# EasyEDA Pro project 硬件部分大作业  大一  徐子涵 学号2025210236.epro, board PCB3
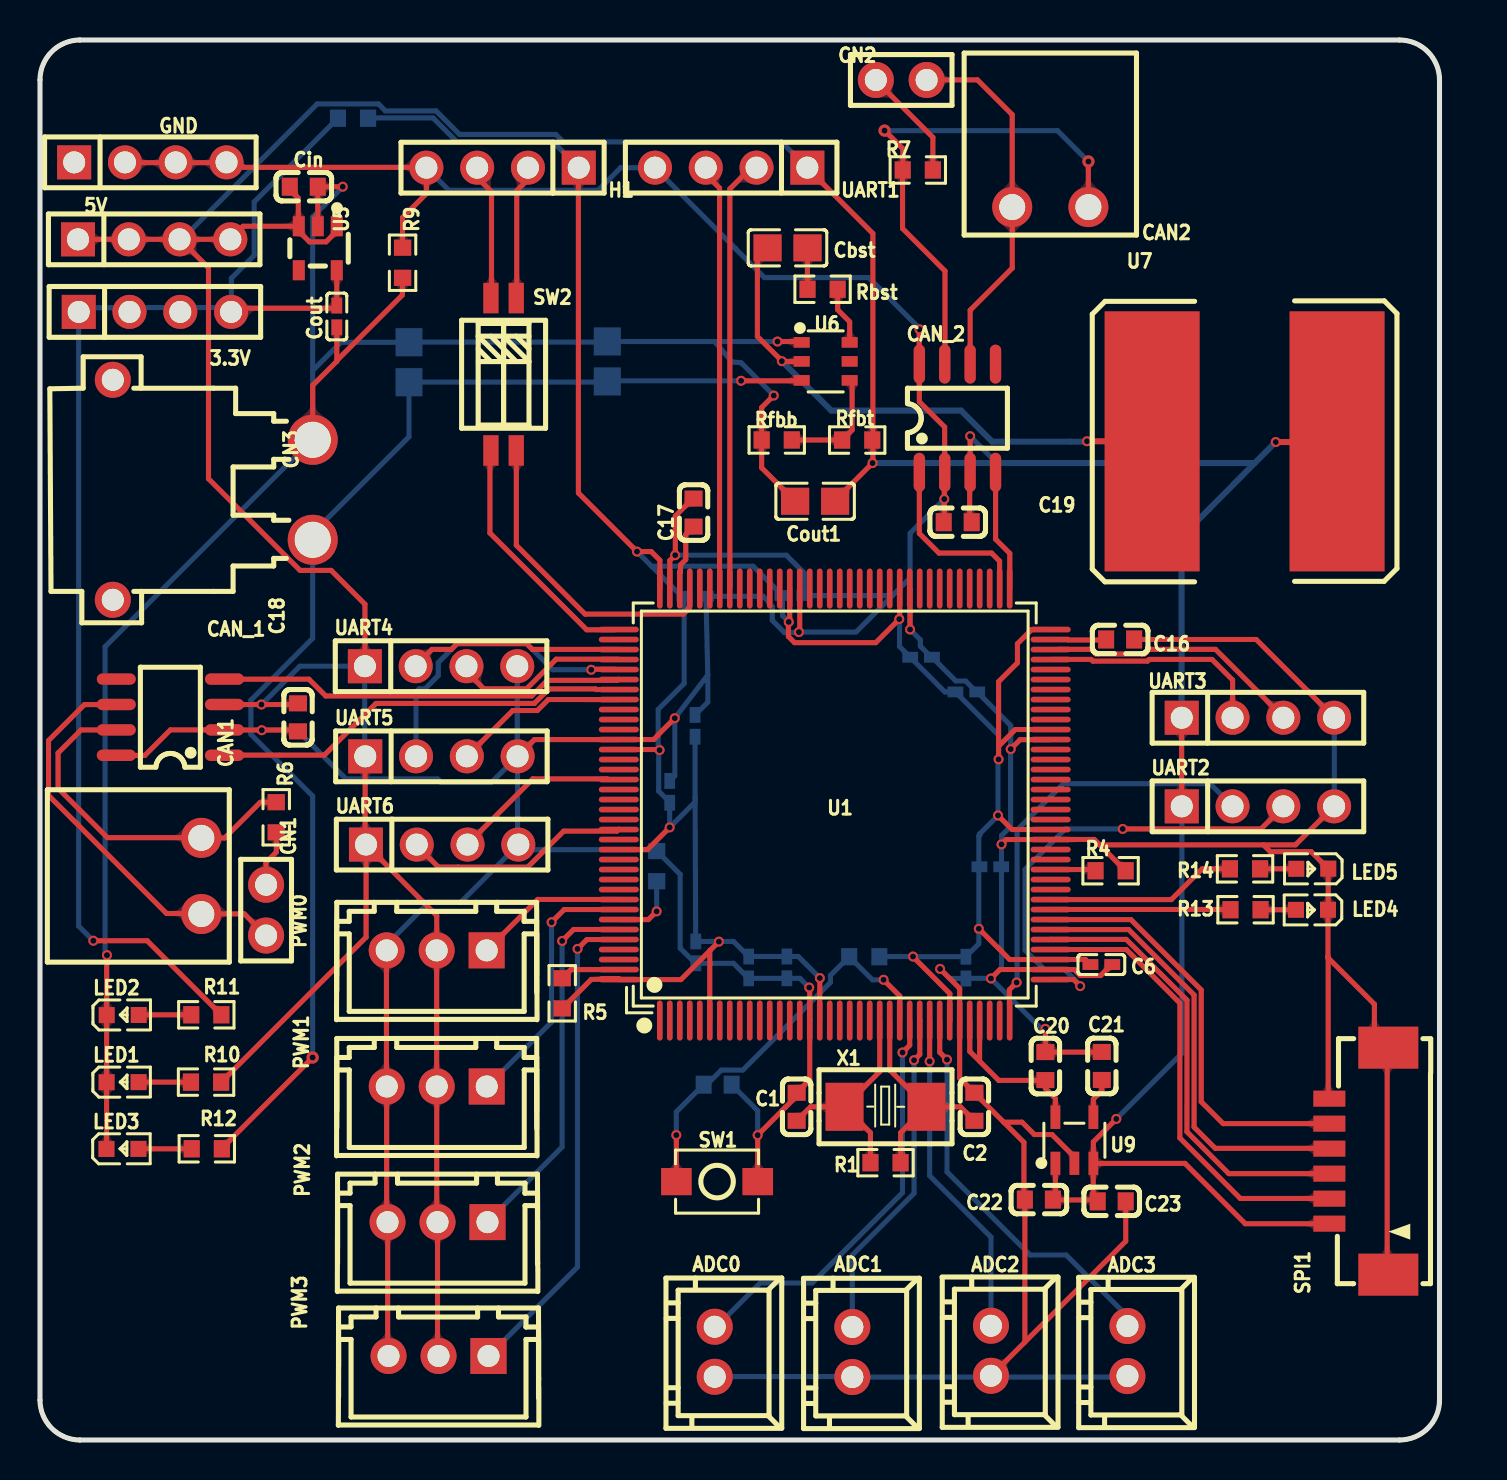
[diagram p1: board, top side]
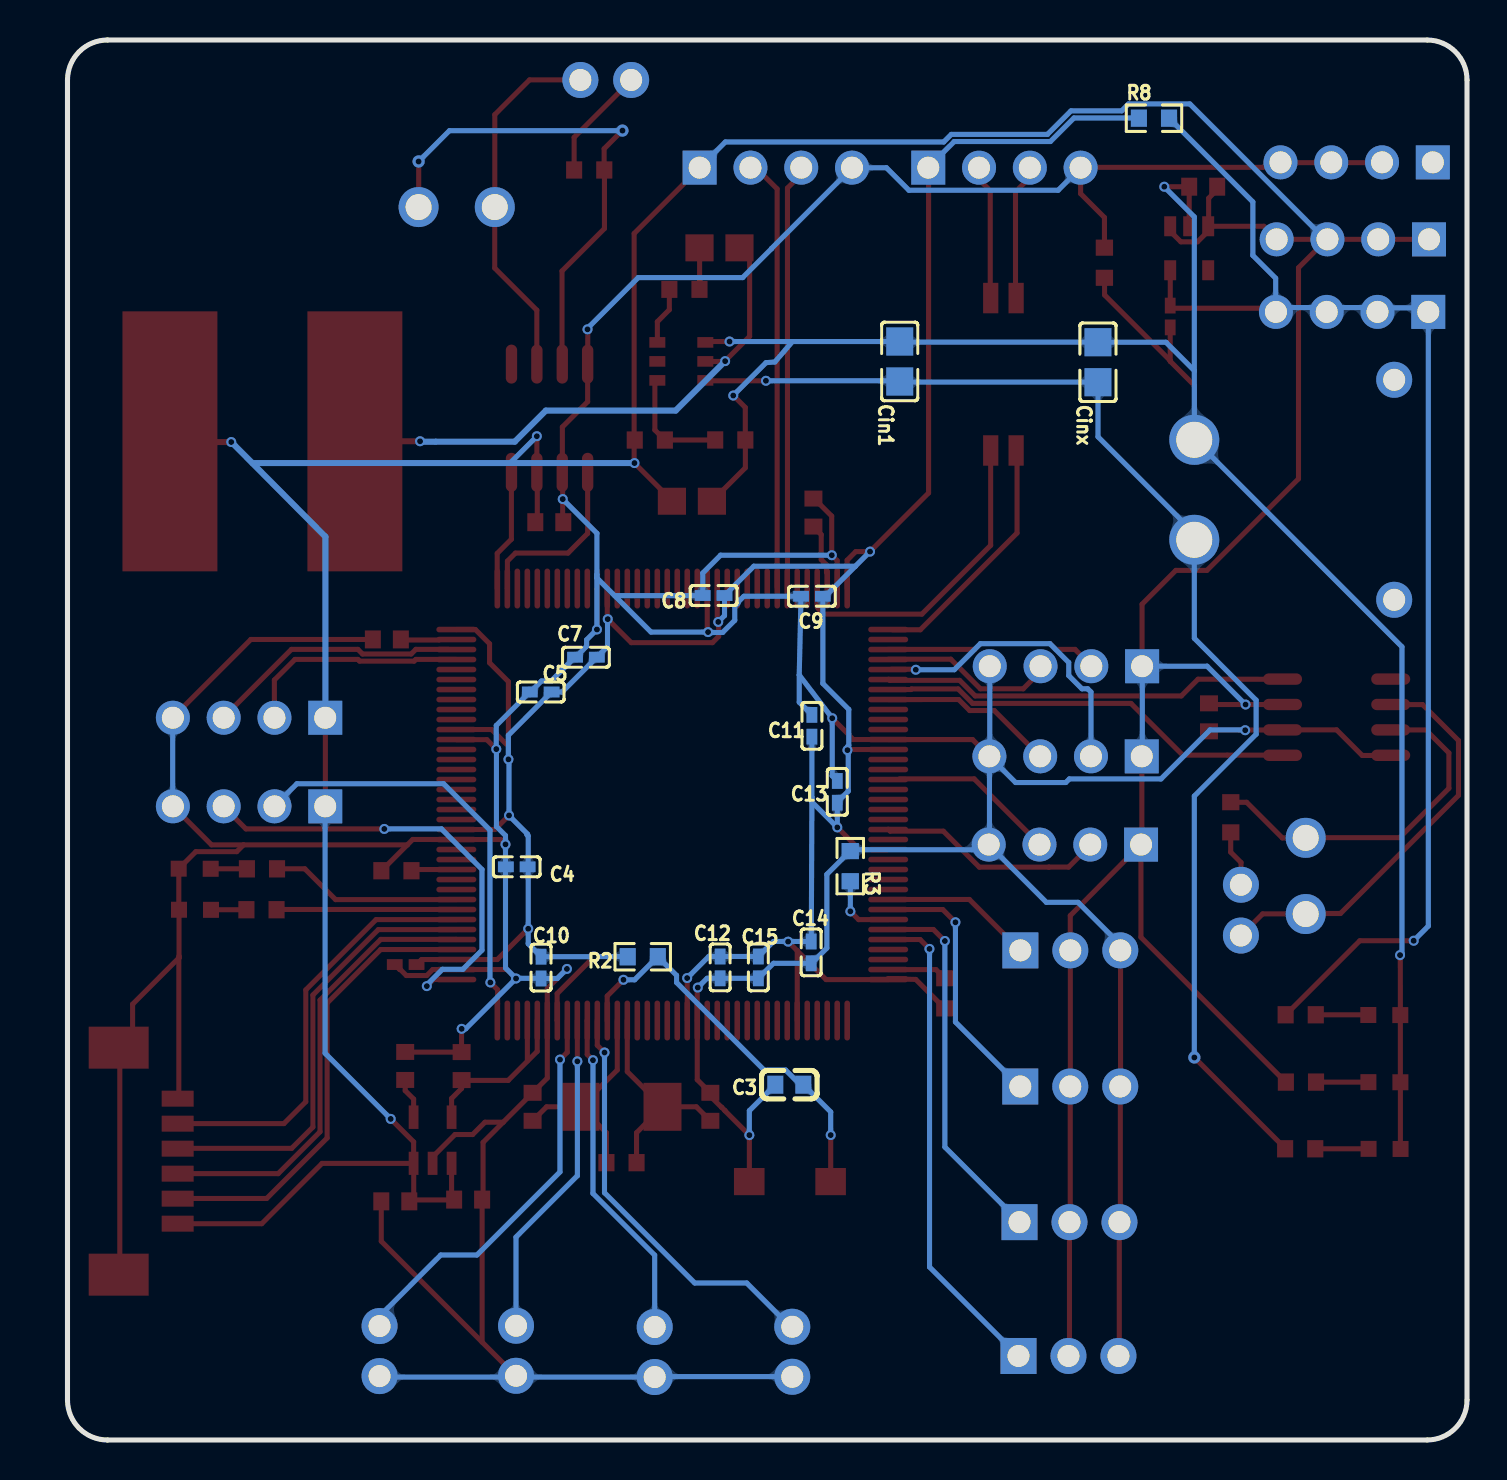
[diagram p2: board, bottom side, seen from below]

Outline 70 x 70 mm; copper layers: Top Layer, Bottom Layer. Coordinates in mm from the lower left corner of the outline.
Outline path: 0,68 0,2 arc(0.59,0.59) 2,0 68,0 arc(69.41,0.59) 70,2 70,68 arc(69.41,69.41) 68,70 2,70 arc(0.59,69.41) 0,68
Stack: Top Layer 0.035mm / Dielectric1 1.51mm FR4 er 4.5 / Bottom Layer 0.035mm

## Design rules (mm)
template: JLCPCB Capability(Two Layers Board)
spacing copperThickness1oz (default): track to track 0.102, other pairs 0.152 to 0.3
spacing copperThickness2oz: track to track 0.203, other pairs 0.152 to 0.3
track width copperThickness1oz (default): min 0.127, default 0.254, max 2.54
track width copperThickness2oz: min 0.203, default 0.254, max 2.54
differential pair differentialPair (default): width min 0.127, default 0.254, max 2.54; gap min 0.152, default 0.152
via viaSize (default): diameter min 0.5, default 0.61, max 10; hole min 0.3, default 0.305, max 6.3

## Placement (name value [footprint] x y rotation side)
3.3V  SIP4-CON4排针  [HDR-TH_4P-P2.54-V-M-3]  5.75 56.41 0 top
5V  SIP4-CON4排针  [HDR-TH_4P-P2.54-V-M-3]  5.71 60.03 0 top
ADC0  XH-D-2A  [CONN-TH_XH-2A]  33.75 4.41 270 top
ADC1  XH-D-2A  [CONN-TH_XH-2A]  40.63 4.4 270 top
ADC2  XH-D-2A  [CONN-TH_XH-2A]  47.57 4.46 270 top
ADC3  XH-D-2A  [CONN-TH_XH-2A]  54.39 4.45 270 top
C1  22pF  [C0603]  37.85 16.66 90 top
C2  22pF  [C0603]  46.74 16.66 90 top
C3  0.1uF  [C0603]  33.89 17.77 180 bottom
C4  0.1u  [C0402]  47.53 28.66 0 bottom
C5  0.1u  [C0402]  46.33 37.4 0 bottom
C6  0.1u  [C0402]  53.09 23.77 0 top
C7  0.1u  [C0402]  44.07 39.14 0 bottom
C8  0.1u  [C0402]  37.68 42.22 0 bottom
C9  0.1u  [C0402]  32.77 42.19 0 bottom
C10  0.1u  [C0402]  46.31 23.62 270 bottom
C11  0.1u  [C0402]  32.77 35.71 90 bottom
C12  0.1u  [C0402]  37.36 23.63 270 bottom
C13  0.1u  [C0402]  31.5 32.41 90 bottom
C14  0.1u  [C0402]  32.8 24.38 270 bottom
C15  0.1u  [C0402]  35.45 23.63 270 bottom
C16  2.2u  [C0603]  54.03 40.03 180 top
C17  2.2u  [C0603]  32.69 46.37 90 top
C18  0.1u  [C0603]  12.91 36.13 270 top
C19  0.1u  [C0603]  45.9 45.89 180 top
C20  10uF  [C0603]  50.29 18.7 270 top
C21  22nF  [C0603]  53.11 18.7 270 top
C22  10uF  [C0603]  49.96 12.02 0 top
C23  100nF  [C0603]  53.6 11.93 180 top
CAN1  XY2500R-F-3.81-2P  [CONN-TH_XY2500R-F-3.81-2P]  8.07 28.2 270 top
CAN2  XY2500R-F-3.81-2P  [CONN-TH_XY2500R-F-3.81-2P]  50.53 61.65 180 top
CAN_1  TJA1050T/CM,118  [SOIC-8_L5.0-W4.0-P1.27-LS6.0-BL]  6.52 36.14 90 top
CAN_2  TJA1050T/CM,118  [SOIC-8_L5.0-W4.0-P1.27-LS6.0-BL]  45.89 51.09 0 top
Cbst  100nF  [C0805]  37.39 59.61 180 top
Cin  1uF  [C0603]  13.2 62.66 180 top
Cin1  10uF  [C0805]  28.37 53.93 90 bottom
Cinx  100nF  [C0805]  18.46 53.89 90 bottom
CN1  JMP1  [HDR-TH_2P-P2.54_C9900022687]  11.31 26.49 270 top
CN2  JMP2  [HDR-TH_2P-P2.54_C9900022687]  43.08 68 0 top
CN3  XT30PW-M30.G.Y  [CONN-TH_XT30PW-M]  8.64 47.51 270 top
Cout  1uF  [C0402]  14.85 56.18 90 top
Cout1  22uF  [C0805]  38.77 46.94 0 top
GND  SIP4-CON4排针  [HDR-TH_4P-P2.54-V-M-3]  5.52 63.88 0 top
H1  2.5-4PIN  [HDR-TH_4P-P2.54-V-M]  23.14 63.62 180 top
LED1  -  [LED_0603]  4.18 17.9 0 top
LED2  -  [LED_0603]  4.19 21.26 0 top
LED3  -  [LED_0603]  4.18 14.56 0 top
LED4  -  [LED_0603]  63.57 26.5 180 top
LED5  -  [LED_0603]  63.59 28.56 180 top
PWM0  HX25003-3A  [CONN-TH_3P-P2.50_HX25003-3A]  19.84 24.48 0 top
PWM1  HX25003-3A  [CONN-TH_3P-P2.50_HX25003-3A]  19.84 17.68 0 top
PWM2  HX25003-3A  [CONN-TH_3P-P2.50_HX25003-3A]  19.88 10.89 0 top
PWM3  HX25003-3A  [CONN-TH_3P-P2.50_HX25003-3A]  19.93 4.2 0 top
R1  1M  [R0603]  42.29 13.87 180 top
R2  10k  [R0603]  41.23 24.16 0 bottom
R3  10K  [R0603]  30.85 28.69 90 bottom
R4  10K  [R0603]  53.55 28.46 0 top
R5  0R  [R0603]  26.12 22.33 270 top
R6  120  [R0603]  11.82 31.14 270 top
R7  120  [R0603]  43.91 63.5 0 top
R8  0  [R0603]  15.66 66.09 180 bottom
R9  0  [R0603]  18.14 58.86 270 top
R10  15K  [R0603]  8.31 17.9 180 top
R11  10K  [R0603]  8.32 21.26 180 top
R12  72K  [R0603]  8.34 14.56 180 top
R13  10K  [R0603]  60.3 26.51 0 top
R14  10K  [R0603]  60.27 28.56 0 top
Rbst  30Ω  [R0603]  39.14 57.54 180 top
Rfbb  10kΩ  [R0603]  36.85 50 0 top
Rfbt  52.3kΩ  [R0603]  40.87 50 0 top
SPI1  M1250RS-06P  [CONN-SMD_M1250RS-06P]  65.96 13.94 90 top
SW1  -  [Key_SMD_3x4x2]  33.87 12.92 0 top
SW2  DSHP02TSGET  [SW-SMD_4P_DSHP02TSGET]  23.19 53.29 180 top
U1  STM32F407ZGT6  [LQFP-144_L20.0-W20.0-P0.50-LS22.0-BL]  39.75 31.77 0 top
U5  LP5907MFX-3.0/NOPB(MS)  [SOT-23-5_L2.9-W1.6-P0.95-LS2.8-BR]  13.9 59.59 90 top
U6  TPS56339DDCR  [TSOT-23-6_L2.9-W1.6-P0.95-LS2.8-BR]  39.3 53.93 180 top
U7  5.6uH  [IND-SMD_L13.0-W13.0-SDR1307-XXXXX]  60.25 49.93 0 top
U9  RT9193-33GB  [SOT-23-5_L3.0-W1.7-P0.95-LS2.8-BL]  51.74 14.99 0 top
UART1  SIP4-CON4排针  [HDR-TH_4P-P2.54-V-M-3]  34.57 63.62 180 top
UART2  SIP4-CON4排针  [HDR-TH_4P-P2.54-V-M-3]  60.92 31.68 0 top
UART3  SIP4-CON4排针  [HDR-TH_4P-P2.54-V-M-3]  60.92 36.11 0 top
UART4  SIP4-CON4排针  [HDR-TH_4P-P2.54-V-M-3]  20.06 38.69 0 top
UART5  SIP4-CON4排针  [HDR-TH_4P-P2.54-V-M-3]  20.08 34.18 0 top
UART6  SIP4-CON4排针  [HDR-TH_4P-P2.54-V-M-3]  20.11 29.77 0 top
X1  8MHz  [CRYSTAL-SMD_L5.0-W3.2]  42.29 16.66 180 top

## Footprints (pads in the part's own frame, mm; a bottom-side part is the same pattern mirrored in y, then rotated)
C0402
  rect 0.79x0.54 smd: 1(-0.545,0) 2(0.545,0)
C0603
  rect 0.8x0.9 smd: 1(-0.7,0) 2(0.7,0)
C0805
  rect 1.41x1.35 smd: 1(-1,0) 2(1,0)
CONN-SMD_M1250RS-06P
  rect 0.8x1.6 smd: 1(-3.125,1.475) 2(-1.875,1.475) 3(-0.625,1.475) 4(0.625,1.475) 5(1.875,1.475) 6(3.125,1.475)
  rect 2.1x3 smd: 7(5.675,-1.475) 8(-5.675,-1.475)
CONN-TH_3P-P2.50_HX25003-3A
  rect 1.8x1.8 hole 1.1: 1(2.5,0)
  round 1.8 hole 1.1: 2(0,0) 3(-2.5,0)
CONN-TH_XH-2A
  round 1.8 hole 1.1: 1(-1.251,0) 2(1.251,0)
CONN-TH_XT30PW-M
  round 2.5 hole 1.8: 1(-2.5,5) 2(2.5,5)
  round 1.8 hole 1.1: 3(5.5,-5) 4(-5.5,-5)
CONN-TH_XY2500R-F-3.81-2P
  round 2 hole 1.3: 1(-1.905,0) 2(1.905,0)
CRYSTAL-SMD_L5.0-W3.2
  rect 1.9x2.4 smd: 1(-2.05,0) 2(2.05,0)
HDR-TH_2P-P2.54_C9900022687
  round 1.8 hole 1.1: 1(-1.27,0) 2(1.27,0)
HDR-TH_4P-P2.54-V-M
  rect 1.7x1.7 hole 1.1: 1(-3.81,0)
  round 1.7 hole 1.1: 2(-1.27,0) 3(1.27,0) 4(3.81,0)
HDR-TH_4P-P2.54-V-M-3
  rect 1.7x1.7 hole 1.1: 1(-3.81,0)
  round 1.7 hole 1.1: 2(-1.27,0) 3(1.27,0) 4(3.81,0)
IND-SMD_L13.0-W13.0-SDR1307-XXXXX
  rect 4.75x13 smd: 1(-4.625,0) 2(4.625,0)
Key_SMD_3x4x2
  rect 1.53x1.36 smd: 1(-2.035,0) 2(2.035,0)
LED_0603
  rect 0.8x0.8 smd: 1(-0.851,-0.01) 2(0.75,-0.005)
LQFP-144_L20.0-W20.0-P0.50-LS22.0-BL
  oval 0.28x2 smd: 1(-8.75,-10.8) 2(-8.25,-10.8) 3(-7.75,-10.8) 4(-7.25,-10.8) 5(-6.75,-10.8) 6(-6.25,-10.8) 7(-5.75,-10.8) 8(-5.25,-10.8) 9(-4.75,-10.8) 10(-4.25,-10.8) 11(-3.75,-10.8) 12(-3.25,-10.8) 13(-2.75,-10.8) 14(-2.25,-10.8) 15(-1.75,-10.8) 16(-1.25,-10.8) 17(-0.75,-10.8) 18(-0.25,-10.8) 19(0.25,-10.8) 20(0.75,-10.8) 21(1.25,-10.8) 22(1.75,-10.8) 23(2.25,-10.8) 24(2.75,-10.8) 25(3.25,-10.8) 26(3.75,-10.8) 27(4.25,-10.8) 28(4.75,-10.8) 29(5.25,-10.8) 30(5.75,-10.8) 31(6.25,-10.8) 32(6.75,-10.8) 33(7.25,-10.8) 34(7.75,-10.8) 35(8.25,-10.8) 36(8.75,-10.8) 73(8.75,10.8) 74(8.25,10.8) 75(7.75,10.8) 76(7.25,10.8) 77(6.75,10.8) 78(6.25,10.8) 79(5.75,10.8) 80(5.25,10.8) 81(4.75,10.8) 82(4.25,10.8) 83(3.75,10.8) 84(3.25,10.8) 85(2.75,10.8) 86(2.25,10.8) 87(1.75,10.8) 88(1.25,10.8) 89(0.75,10.8) 90(0.25,10.8) 91(-0.25,10.8) 92(-0.75,10.8) 93(-1.25,10.8) 94(-1.75,10.8) 95(-2.25,10.8) 96(-2.75,10.8) 97(-3.25,10.8) 98(-3.75,10.8) 99(-4.25,10.8) 100(-4.75,10.8) 101(-5.25,10.8) 102(-5.75,10.8) 103(-6.25,10.8) 104(-6.75,10.8) 105(-7.25,10.8) 106(-7.75,10.8) 107(-8.25,10.8) 108(-8.75,10.8)
  oval 2x0.28 smd: 37(10.8,-8.75) 38(10.8,-8.25) 39(10.8,-7.75) 40(10.8,-7.25) 41(10.8,-6.75) 42(10.8,-6.25) 43(10.8,-5.75) 44(10.8,-5.25) 45(10.8,-4.75) 46(10.8,-4.25) 47(10.8,-3.75) 48(10.8,-3.25) 49(10.8,-2.75) 50(10.8,-2.25) 51(10.8,-1.75) 52(10.8,-1.25) 53(10.8,-0.75) 54(10.8,-0.25) 55(10.8,0.25) 56(10.8,0.75) 57(10.8,1.25) 58(10.8,1.75) 59(10.8,2.25) 60(10.8,2.75) 61(10.8,3.25) 62(10.8,3.75) 63(10.8,4.25) 64(10.8,4.75) 65(10.8,5.25) 66(10.8,5.75) 67(10.8,6.25) 68(10.8,6.75) 69(10.8,7.25) 70(10.8,7.75) 71(10.8,8.25) 72(10.8,8.75) 109(-10.8,8.75) 110(-10.8,8.25) 111(-10.8,7.75) 112(-10.8,7.25) 113(-10.8,6.75) 114(-10.8,6.25) 115(-10.8,5.75) 116(-10.8,5.25) 117(-10.8,4.75) 118(-10.8,4.25) 119(-10.8,3.75) 120(-10.8,3.25) 121(-10.8,2.75) 122(-10.8,2.25) 123(-10.8,1.75) 124(-10.8,1.25) 125(-10.8,0.75) 126(-10.8,0.25) 127(-10.8,-0.25) 128(-10.8,-0.75) 129(-10.8,-1.25) 130(-10.8,-1.75) 131(-10.8,-2.25) 132(-10.8,-2.75) 133(-10.8,-3.25) 134(-10.8,-3.75) 135(-10.8,-4.25) 136(-10.8,-4.75) 137(-10.8,-5.25) 138(-10.8,-5.75) 139(-10.8,-6.25) 140(-10.8,-6.75) 141(-10.8,-7.25) 142(-10.8,-7.75) 143(-10.8,-8.25) 144(-10.8,-8.75)
R0603
  rect 0.806x0.864 smd: 1(-0.753,0) 2(0.753,0)
SOIC-8_L5.0-W4.0-P1.27-LS6.0-BL
  oval 0.569x1.95 smd: 1(-1.905,-2.705) 2(-0.635,-2.705) 3(0.635,-2.705) 4(1.905,-2.705) 5(1.905,2.705) 6(0.635,2.705) 7(-0.635,2.705) 8(-1.905,2.705)
SOT-23-5_L2.9-W1.6-P0.95-LS2.8-BR
  rect 1x0.6 smd: 1(1.1,-0.95) 2(1.1,0) 3(1.1,0.95) 4(-1.1,0.95) 5(-1.1,-0.95)
SOT-23-5_L3.0-W1.7-P0.95-LS2.8-BL
  rect 0.49x1.157 smd: 1(-0.95,-1.153) 2(0,-1.153) 3(0.95,-1.153)
  rect 0.49x1.175 smd: 4(0.95,1.153) 5(-0.95,1.153)
SW-SMD_4P_DSHP02TSGET
  rect 0.762x1.524 smd: 1(-0.635,-3.81) 2(0.635,-3.81) 3(0.635,3.81) 4(-0.635,3.81)
TSOT-23-6_L2.9-W1.6-P0.95-LS2.8-BR
  rect 0.8x0.532 smd: 1(1.2,-0.95) 2(1.2,0) 3(1.2,0.95) 4(-1.2,0.95) 5(-1.2,0) 6(-1.2,-0.95)

## Nets
As in the schematic.

Pads without a net: CAN_1 5; CAN_2 5; CN3 3 4; U1 1 2 3 4 5 7 8 9 10 11 12 13 14 15 18 19 20 21 22 34 35 46 47 49 50 53 54 55 56 57 58 59 60 63 64 65 66 67 68 75 76 77 78 79 80 81 82 85 86 87 88 89 90 91 92 93 96 97 98 99 100 103 104 110 117 118 119 122 123 125 126 127 128 130 132 133 134 135 141 142; U5 4; U6 5

## Via types
v1: diameter 0.5, hole 0.3, Top Layer to Bottom Layer, 49 vias
v2: diameter 0.5, hole 0.305, Top Layer to Bottom Layer, 3 vias
v3: diameter 0.61, hole 0.305, Top Layer to Bottom Layer, 3 vias

## Routing (per net, layer and track width the routed paths; a pad name or vN(x,y) marks a point on that pad's centre or on a via; arc(x,y) is an arc through that point)
3.3V: length 66.4
  Top Layer w0.254: 9.07,21.26 5.36,24.96 v2(2.67,24.96) ; 14.85,56.73 14.84,56.73 ; 14.84,56.73 14.84,58.48 ; 14.84,56.73 14.7,56.59 9.8,56.59 9.54,56.33
  Bottom Layer w0.254: 9.54,56.62 4.48,56.62 4.47,56.61 1.93,56.61 ; 1.93,56.61 1.93,25.7 v2(2.67,24.96) ; 14.9,66.09 10.71,61.9 10.71,59.23 9.57,58.09 9.57,56.62
24V: length 64.1
  Top Layer w0.254: v3(13.64,19.13) 9.28,14.77 ; 38.1,52.98 38.08,52.96 v1(35.07,52.96)
  Bottom Layer w0.254: v1(35.07,52.96) 28.41,52.96 28.37,52.92 ; 13.64,45.33 13.64,40.08 10.55,36.99 10.55,35.29 13.64,32.2 v3(13.64,19.13) ; 28.36,52.93 28.37,52.92 ; 28.37,52.92 28.37,52.93 ; 28.37,52.92 28.34,52.9 18.47,52.9 ; 18.46,52.9 18.46,50.16 13.65,45.35
+5V: length 243.4
  Top Layer w0.254: 19.84,24.48 19.84,26.22 16.31,29.78 ; 52.66,13.83 52.68,13.83 52.68,12.15 52.83,12 ; 19.88,10.89 19.88,10.89 ; 19.88,10.89 19.88,10.9 ; 19.88,10.89 19.88,4.25 19.93,4.21 ; 12.92,60.69 12.92,62.09 12.5,62.51 12.5,62.66 ; 12.97,60.42 13.48,59.91 14.31,59.91 14.72,60.31 14.72,60.31 ; v1(53.83,16.06) 52.69,14.91 52.69,13.83 ; 9.06,17.89 16.31,25.14 16.31,29.77 ; 52.69,13.83 57.27,13.83 60.28,10.81 64.48,10.81 64.49,10.81 ; 2.45,60.05 1.97,60.53 ; 9.52,60.05 10.16,60.69 12.94,60.69 ; 9.74,60.69 9.59,60.54 ; 50.79,13.8 50.79,12.08 ; 7.01,60.03 8.43,58.61 8.43,48.06 13.01,43.48 14.56,43.48 16.25,41.79 16.25,38.69 16.26,38.69 ; 7.01,60.03 5V.2 2.45,60.03 ; 7.01,60.03 9.09,60.03 ; 46.5,48.29 46.5,45.98 46.61,45.87 ; 46.52,48.39 46.52,50.19 46.52,50.19 ; 16.26,34.19 16.26,29.82 ; 19.84,24.47 19.84,17.68 19.84,17.67 19.84,10.93 ; 57.1,36.12 57.1,31.71 ; 50.7,11.99 50.62,11.91 ; 12.85,36.77 v1(11.08,36.77) 9.23,36.77 ; 9.58,60.54 9.58,60.54 ; 52.83,12 50.68,12 ; 52.83,12 52.83,12 52.9,11.93 ; 38.37,63.61 41.66,60.32 41.66,48.86 v1(41.64,48.85) 39.77,46.97 39.77,46.94
  Top Layer w0.3: 61.81,49.9 64.89,49.9 64.92,49.92
  Bottom Layer w0.254: 46.52,50.18 47.86,48.85 ; 38.36,63.64 37.09,64.9 26.17,64.9 25.79,65.28 20.98,65.28 19.81,66.46 17.27,66.46 16.93,66.8 13.86,66.8 7.1,60.04 6.98,60.04 ; 16.24,34.22 16.24,38.69 13,38.69 11.08,36.78 ; 57.11,31.69 57.11,19.34 53.83,16.05
  Bottom Layer w0.3: 61.8,49.9 57.1,45.17 57.1,36.13 ; v1(41.64,48.85) 60.75,48.85
  vias: v1(46.52,50.19) v1(61.81,49.9)
GND: length 380.8
  Top Layer w0.254: 47.57,3.2 49.26,4.9 54.31,9.94 54.31,11.93 ; 50.29,19.39 50.29,19.39 ; 50.29,19.39 53.11,19.39 ; 50.29,19.39 50.29,20.55 50.29,20.56 ; 50.55,35.02 49.03,35.02 v1(48.55,34.55) ; 64.43,24.1 64.43,17.12 64.49,17.06 ; 64.43,24.1 64.42,24.19 ; 64.43,24.1 66.74,21.79 66.74,19.62 66.73,19.61 ; 64.43,24.1 64.42,24.11 64.42,24.19 ; v1(48.09,29.78) 48.09,29.79 48.33,30.02 50.54,30.02 52.73,30.03 53,29.76 ; 64.42,24.19 64.42,26.51 64.42,26.51 ; 54.71,40.03 60.83,40.03 64.73,36.13 ; 37.84,17.36 37.84,17.19 37.29,16.64 37.28,16.64 37.12,16.48 37.12,16.46 35.9,15.25 ; v1(43.52,40.53) 43.52,42.56 U1.83 ; 64.43,28.56 64.43,26.53 ; U1.107 31.5,43.97 v1(31.77,44.24) ; 12.9,35.43 12.83,35.5 9.23,35.5 ; 4.25,63.87 9.96,63.87 10.19,63.63 19.33,63.63 19.33,62.32 18.13,61.13 18.13,59.61 ; v1(37.96,40.4) 38,40.44 U1.94 ; 49.38,11.91 49.26,11.91 ; 49.26,11.91 49.21,12.06 49.21,14.88 48.21,15.89 ; 49.26,11.91 49.26,4.9 ; 45.25,48.39 45.25,50.65 43.98,51.91 43.98,53.77 43.98,55.53 43.99,55.54 ; 61.2,29.76 62.8,29.76 64.73,31.69 ; 61.2,29.76 53,29.76 ; 61.2,29.76 61.54,29.42 63.58,29.42 64.44,28.56 ; 17.39,10.89 17.39,4.25 17.43,4.21 ; v1(47.56,23.08) 48.01,23.52 51.73,23.52 52.03,23.22 53.05,23.22 53.35,23.52 53.38,23.52 C6.2 ; 45.23,48.28 45.23,45.91 45.2,45.87 ; v1(45.02,23.55) 46,22.57 U1.31 46,18.1 46.73,17.36 48.21,15.89 ; 35.9,12.92 35.89,12.93 v1(35.89,15.24) ; 67.38,19.67 67.38,8.28 ; 31.78,44.26 31.78,46.2 32.52,46.94 ; 53,29.76 54.3,28.46 ; 28.94,35.02 24.73,35.02 23.89,34.18 ; 17.33,24.48 17.33,17.68 ; v1(31.75,36.09) 30.9,35.24 30.9,35.22 30.7,35.02 U1.120 ; 48.21,15.89 49.12,15.89 49.74,15.27 50.62,15.27 51.76,14.13 51.76,14 ; C1.2 38.5,18.02 U1.16 38.5,22.6 v1(38.47,22.62) ; 9.22,35.51 6.52,35.51 5.24,34.23 3.81,34.23 ; 17.34,17.65 17.34,10.93
  Bottom Layer w0.254: 30.85,29.45 32.02,28.28 32.02,24.59 32.78,23.83 34.69,23.83 ; 23.88,29.81 23.88,34.18 ; 43.52,43.27 43.52,43.11 43.52,43.1 ; 43.52,43.27 43.52,43.1 ; 43.52,43.27 43.52,45.33 45.23,47.04 ; 11.09,35.51 12.85,35.51 15.3,33.05 19.89,33.05 20.07,32.87 22.58,32.87 23.88,34.18 ; C8.2 38.23,43.35 37.33,44.24 v1(31.77,44.24) ; 43.98,55.54 43.98,55.59 41.45,58.12 36.23,58.12 34.79,59.56 34.79,59.57 30.76,63.61 ; 44.61,39.14 44.58,39.14 44.03,39.69 44.03,40.01 v1(43.52,40.53) ; 38.01,23.09 38.48,22.62 ; 33.4,38.25 v1(31.75,36.09) 31.75,33.21 C13.2 ; 33.4,38.25 C9.2 36.17,42.19 36.46,41.89 36.46,41.84 36.63,41.68 36.63,40.98 37.23,40.38 37.94,40.38 v1(37.96,40.4) ; 33.4,38.25 33.4,36.89 C11.2 ; 23.92,29.77 24.18,29.51 30.79,29.51 ; 23.92,29.77 21.04,26.88 19.45,26.88 17.34,24.77 17.34,24.48 ; 23.92,29.77 23.91,29.78 ; 43.52,43.1 40.81,40.4 37.96,40.4 ; 43.52,43.1 43.52,40.53 ; v1(50.29,20.56) 50.08,20.56 v1(47.56,23.08) 48.09,23.6 v1(48.09,29.78) 48.09,30.22 48.55,30.68 48.55,34.54 v1(48.55,34.55) ; 47.57,3.15 54.34,3.15 54.39,3.2 ; 47.53,3.18 47.57,3.21 ; 23.88,34.19 23.88,34.18 ; 30.76,63.62 30.75,63.61 29.04,63.61 27.91,62.49 20.45,62.49 19.33,63.6 19.33,63.61 ; 33.74,3.17 40.6,3.17 40.62,3.15 47.5,3.15 ; 38.01,23.08 35.45,23.08 35.45,23.08 34.69,23.84 ; 48.55,34.55 48.55,35.72 46.87,37.4 ; C3.1 35.89,16.47 v1(35.89,15.24) ; 46.85,37.4 46.3,37.95 45.81,37.95 44.61,39.14 ; C10.2 45.5,23.08 45.02,23.56 ; 47.57,23.08 46.33,23.08 46.32,23.07 ; 38.23,42.22 42.63,42.22 ; 64.74,36.11 64.74,31.7 64.72,31.68 ; 23.87,38.67 23.87,34.21
  vias: v1(11.09,35.49) v1(43.99,55.53) v2(45.23,47.05)
PGND: length 103.2
  Top Layer w0.254: 18.13,58.11 18.13,57.25 14.85,53.97 ; 13.67,50.01 13.64,50.05 13.64,52.74 14.84,53.93 ; 14.84,53.97 14.85,53.97 ; 14.85,53.97 14.85,53.95 14.84,53.93 ; 14.85,53.97 14.85,55.63 ; 3.33,21.24 3.33,21.25 ; 3.33,21.24 3.33,17.89 ; 3.33,21.24 3.34,24.23 v2(3.35,24.24) ; v1(36.89,54.92) 38.04,54.92 38.05,54.93 ; 36.1,50.01 36.1,51.63 36.7,52.23 ; 37.77,46.94 36.1,48.61 36.1,50 ; 14.84,53.93 14.85,53.94 ; 3.32,14.55 3.33,14.56 LED1.1 ; 13.9,62.66 15.14,62.66 15.14,62.66 ; 13.9,62.66 13.9,60.69 ; 36.09,50 36.09,49.99
  Bottom Layer w0.254: 13.64,50.33 13.64,50.33 ; 13.64,50.33 13.64,50.04 3.25,39.66 3.25,24.34 v2(3.35,24.24) ; 13.64,50.33 13.64,53.47 ; 13.64,53.47 13.64,61.15 15.14,62.66 ; 13.64,53.47 15.05,54.89 18.44,54.89 ; 36.7,52.22 35.06,53.87 34.62,53.9 33.74,54.92 ; 33.74,54.92 v1(36.89,54.92) ; 33.74,54.92 28.39,54.92 ; 18.46,54.89 28.34,54.89
  vias: v1(15.14,62.66) v1(36.7,52.22)
VDD: length 157.5
  Top Layer w0.254: v1(39.01,23.1) 39,23.09 39,22.4 U1.17 ; U1.131 30.39,29.52 v1(31.5,30.63) ; 52.54,23.77 52.29,24.02 48.5,24.02 46.96,25.56 v1(46.96,25.56) ; 47.95,34.69 v1(47.95,34.03) ; 47.95,34.69 47.95,37.92 48.89,38.86 48.89,39.81 49.6,40.53 50.54,40.53 50.55,40.52 ; 47.95,34.69 48.78,35.52 50.55,35.52 ; 33.5,24.46 32.06,23.02 28.95,23.02 ; 33.5,24.46 33.5,20.97 ; 33.5,24.46 33.5,24.47 v1(33.96,24.92) ; 28.08,23.07 28.95,23.07 27.57,23.03 26.12,21.58 ; U1.95 37.5,40.95 v1(37.45,40.9) 37.43,40.88 37.43,40.18 37.74,39.87 41.8,39.87 v1(42.98,41.04) 43,41.07 U1.84 ; v1(43.67,24.17) 43.67,24.16 45.51,22.32 45.51,20.98 45.5,20.97 ; 26.93,63.62 26.93,47.35 29.86,44.42 ; 31.01,42.57 31.01,43.99 30.57,44.42 29.86,44.42 ; v1(30.99,34.49) 30.96,34.52 U1.121 ; 50.55,30.52 48.62,30.52 v1(47.92,31.23)
  Bottom Layer w0.254: 32.77,32.14 C11.1 ; 32.77,32.14 32.77,31.9 v1(31.5,30.63) C13.1 31.5,31.89 30.95,32.44 30.95,34.45 v1(30.99,34.49) 30.99,34.67 30.92,34.73 30.92,36.53 32.22,37.83 32.22,42.18 32.22,42.18 ; 32.77,32.14 32.8,24.95 ; v1(37.45,40.9) 37.14,41.22 C8.1 35.67,43.69 30.59,43.69 ; 35.45,24.17 34.69,24.93 32.83,24.93 32.8,24.95 ; 46.31,24.17 46.96,24.81 46.96,30.2 47.02,30.26 46.99,30.29 47.92,31.22 ; 46.31,24.17 43.67,24.17 43.66,24.17 41.99,24.17 41.98,24.17 ; 46.31,24.17 46.31,24.16 ; 32.09,42.19 30.59,43.69 ; 30.59,43.69 v1(29.86,44.42) ; 47.95,34.04 47.95,35.24 45.79,37.4 ; v1(42.98,41.04) 42.99,41.03 42.99,39.67 43.52,39.14 45.26,37.4 C5.1 ; 35.45,24.18 37.93,24.18 v1(39.01,23.1) ; 32.8,24.95 32.8,24.96 ; 32.8,24.95 32.8,24.94 ; 47.92,34.03 v1(47.92,31.23) ; 16.39,66.1 19.66,66.1 20.84,64.92 25.65,64.92 26.95,63.62
VDDA: length 10.1
  Top Layer w0.254: 50.29,17.98 50.29,17.58 50.79,17.08 50.79,16.11 ; 50.29,17.98 50.29,18 ; 50.29,17.98 50.32,17.98 ; 50.29,17.98 47.96,17.98 46.51,19.43 46.51,20.97 ; 47,20.97 47,18.95
ADC0: length 20.9
  Top Layer w0.254: 43.5,20.97 43.5,19.74 v1(43.14,19.37)
  Bottom Layer w0.254: 33.75,5.66 33.84,5.66 36.02,7.85 38.63,7.85 43.14,12.36 43.14,19.38
ADC1: length 16.7
  Top Layer w0.254: 43.72,18.99 44.01,19.28 44.01,20.97 44,20.97
  Bottom Layer w0.254: 40.63,5.65 40.63,9.24 43.72,12.33 v1(43.72,18.99)
ADC2: length 16.5
  Top Layer w0.254: v1(44.5,18.93) 44.5,18.94 44.5,20.97
  Bottom Layer w0.254: 44.5,18.93 44.5,13.21 47.57,10.14 47.57,5.72
ADC3: length 20.2
  Top Layer w0.254: 45.37,19.02 45,19.39 45,20.97
  Bottom Layer w0.254: 45.37,19.02 45.37,13.4 49.52,9.25 51.33,9.25 54.41,6.17 54.41,5.69
  vias: v1(45.37,19.02)
BOOT0: length 3.6
  Top Layer w0.254: v1(30.84,26.43) 30.43,26.02 28.95,26.02
  Bottom Layer w0.254: v1(30.84,26.43) 30.84,27.94
BOOT1: length 1.5
  Top Layer w0.254: 51.21,28.52 52.74,28.52
CAN1_RX: length 20.4
  Top Layer w0.254: 9.23,38.05 9.25,38.04 13.45,38.04 14.29,37.2 24.6,37.2 25.38,37.98 28.87,37.98 28.93,38.04
CAN1_TX: length 21.1
  Top Layer w0.254: 9.23,34.24 9.24,34.24 11.99,34.24 ; 28.95,37.52 27.82,37.52 27.79,37.55 25.45,37.55 24.73,36.83 16.81,36.83 14.22,34.24 11.99,34.24
CAN1H: length 17.7
  Top Layer w0.254: 8.06,30.1 9.24,30.1 11.02,31.89 11.82,31.89 ; 3.82,35.5 2.06,35.5 0.91,34.35 0.91,32.58 3.37,30.12 7.99,30.12
CAN1L: length 20.6
  Top Layer w0.254: 11.31,25.22 10.22,26.31 8.07,26.31 ; 8.01,26.33 6.33,26.33 0.43,32.23 0.43,34.98 2.22,36.77 3.81,36.77
CAN2_RX: length 6.1
  Top Layer w0.254: 48.51,42.58 48.51,44.33 47.8,45.04 47.8,48.38
CAN2_TX: length 9
  Top Layer w0.254: 43.98,48.38 43.98,48.38 ; 43.98,48.38 43.98,45.33 44.97,44.35 47.59,44.35 48,43.94 48,42.58 48,42.57
CAN2H: length 26
  Top Layer w0.254: 42.24,65.48 43.16,64.56 43.16,63.5 ; 45.27,53.8 45.27,58.45 43.14,60.57 43.14,63.49 ; 52.44,63.92 52.43,63.91 52.43,61.65
  Bottom Layer w0.254: 52.44,63.92 50.89,65.47 42.24,65.47
  vias: v3(42.24,65.47) v3(52.44,63.93)
CAN2L: length 18.3
  Top Layer w0.254: 48.63,61.64 48.63,61.64 48.63,58.6 46.52,56.49 46.52,53.79 ; 44.35,68.01 46.89,68.01 48.63,66.27 48.63,61.64
PC4: length 9
  Top Layer w0.254: R13.1 59.53,26.53 50.56,26.53
PC5: length 9.6
  Top Layer w0.254: 59.52,28.55 R14.1 58.13,28.56 56.59,27.02 50.55,27.02
PH0: length 11.1
  Top Layer w0.254: R1.2 41.54,15.36 X1.2 ; C1.1 38.55,16.66 X1.2 ; X1.2 42,18.42 U1.23
PH1: length 11.1
  Top Layer w0.254: X1.1 42.5,18.5 U1.24 ; X1.1 43.04,15.36 R1.1 ; X1.1 46.04,16.66 C2.1
PWM0: length 7.7
  Top Layer w0.254: 22.34,24.48 24.89,27.03 28.95,27.03
PWM1: length 13.2
  Top Layer w0.254: 25.6,25.9 26.22,26.52 28.95,26.52
  Bottom Layer w0.254: 22.35,17.66 25.59,20.9 25.59,25.89
  vias: v1(25.59,25.89)
PWM2: length 18.7
  Top Layer w0.254: v1(26.12,24.95) 26.69,25.53 28.95,25.53
  Bottom Layer w0.254: v1(26.12,24.95) 26.12,14.65 22.37,10.9
PWM3: length 24.4
  Top Layer w0.254: v1(26.89,24.55) 27.35,25.02 28.94,25.02
  Bottom Layer w0.254: 22.43,4.2 26.88,8.65 26.88,24.56
RESET: length 20
  Top Layer w0.254: 31.83,12.92 31.83,12.92 31.83,15.25 ; 43.01,20.97 43.01,22.2 42.19,23.01
  Bottom Layer w0.254: 33.19,17.77 31.83,16.4 v1(31.83,15.25) ; 40.47,24.17 41.63,23.01 v1(42.19,23.01) ; 33.36,17.78 34.08,18.5 35.16,18.5 39.54,22.88 39.54,23.23 40.47,24.16
SPI_CLK: length 22.7
  Top Layer w0.254: 64.55,13.24 64.48,13.32 59.46,13.32 57.37,15.41 57.37,21.99 54.33,25.03 50.56,25.03 50.56,25.02
SPI_CS: length 23.1
  Top Layer w0.254: 64.53,12.04 64.49,12.08 60.04,12.08 57.01,15.1 57.01,21.85 54.34,24.52 50.55,24.52
SPI_MISO: length 22.4
  Top Layer w0.254: 64.58,14.54 64.53,14.58 58.79,14.58 57.73,15.64 57.73,22.25 54.45,25.52 50.55,25.52
SPI_MOSI: length 21.5
  Top Layer w0.254: 50.56,26.02 54.56,26.02 58.08,22.5 58.08,16.91 ; 64.5,15.75 64.43,15.82 59.17,15.82 58.08,16.91
STM_SWCLK: length 12.1
  Top Layer w0.254: 22.51,49.22 22.51,45.35 27.34,40.51 28.75,40.51
STM_SWDIO: length 15.7
  Top Layer w0.254: 23.83,49.53 23.83,44.73 27.27,41.29 32.17,41.29 32.42,41.54 32.42,41.56 32.49,41.63 32.49,42.31
SWCLK: length 6.1
  Top Layer w0.254: 22.04,62.96 22.58,62.41 22.58,57.06
SWDIO: length 6
  Top Layer w0.254: 24.3,62.92 23.85,62.47 23.85,57.11
U1A9_TX: length 21.1
  Top Layer w0.254: 35.31,63.36 34.5,62.55 34.5,42.63
U1A10_RX: length 20.7
  Top Layer w0.254: 33.99,42.54 33.99,62.6 33.52,63.06
U2A2_TX: length 21.1
  Top Layer w0.254: 48.49,21.79 48.49,22.52 v1(48.85,22.88)
  Bottom Layer w0.254: v1(48.85,22.88) 48.87,22.9 48.87,30.5 51.19,32.81 58.53,32.81 59.64,31.7
U2A3_RX: length 23.4
  Top Layer w0.254: 50.55,23.03 51.7,23.03 v1(52.03,22.69) ; 62.19,31.67 61.08,30.56 54.15,30.56
  Bottom Layer w0.254: 49.27,28.52 49.27,24.49 50.22,23.53 51.25,23.53 52.09,22.69 ; 49.26,28.52 51.29,30.56 54.15,30.56
  vias: v1(54.15,30.55)
U3B10_TX: length 11.5
  Top Layer w0.254: 59.65,36.11 59.65,38 58.62,39.03 55.48,39.03 55.39,38.94 52.66,38.94 52.58,39.03 50.57,39.03
U3B11_RX: length 12.9
  Top Layer w0.254: 62.2,36.13 58.8,39.53 55.47,39.53 55.24,39.3 52.81,39.3 52.58,39.53 50.94,39.53
U4C10_TX: length 10.7
  Top Layer w0.254: 18.8,38.73 19.61,39.53 20.58,39.53 20.86,39.82 24.34,39.82 24.63,39.53 28.96,39.53
U4C11_RX: length 8.8
  Top Layer w0.254: 28.94,39.04 25.82,39.04 24.34,37.56 22.2,37.56 21.32,38.44 21.32,38.68
U5C12_TX: length 15.1
  Top Layer w0.254: 28.8,38.54 27.59,38.54 27.57,38.52
  Bottom Layer w0.254: 18.81,34.19 18.81,37.4 18.97,37.56 19.26,37.56 19.92,38.22 19.92,38.87 20.86,39.82 24.34,39.82 25.64,38.51 27.57,38.51
  vias: v1(27.57,38.51)
U5D2_RX: length 8.8
  Top Layer w0.254: 21.35,34.18 23.65,36.47 24.87,36.47 25.42,37.02 28.93,37.02
U6G9_RX: length 8.3
  Top Layer w0.254: 21.4,29.8 24.65,33.06 28.38,33.06
U6G14_TX: length 11.4
  Top Layer w0.254: 18.83,29.75 19.93,28.65 20.91,28.65 20.92,28.64 24.39,28.64 26.19,30.44 28.85,30.44 28.95,30.54
$1N6427: length 1.9
  Top Layer w0.254: 51.41,40 53.31,40 53.32,40.02
$1N6459: length 2.6
  Top Layer w0.254: 32.69,45.66 32.3,45.27 32.3,44.02 32.04,43.76 32.04,43.37
$1N6858: length 3
  Top Layer w0.254: 28.95,23.52 26.56,23.52 26.12,23.08
$1N9528: length 2.8
  Top Layer w0.254: 11.82,30.39 11.82,29.39 11.3,28.88 11.3,27.76
$1N9908: length 5.7
  Top Layer w0.254: 41.81,67.98 44.66,65.13 44.66,63.49
$1N19501: length 2.9
  Top Layer w0.254: 40.5,54.88 U6.6 40.5,55.91 39.9,56.51 Rbst.1
$1N19503: length 2.1
  Top Layer w0.254: 38.38,59.61 38.38,57.53
$1N19511: length 27.9
  Top Layer w0.254: 38.1,53.93 37.14,53.93 35.88,55.18 35.88,59.6 36.39,59.6 36.4,59.6
  Top Layer w0.3: 52.36,49.94 55.67,49.94 55.68,49.93
  Bottom Layer w0.3: 51.59,49.91 52.36,49.91 52.37,49.92 ; 51.59,49.92 47.63,49.92 46.07,51.47 39.58,51.47 37.11,53.94
  vias: v1(37.11,53.94) v1(52.37,49.94)
$1N19528: length 5.8
  Top Layer w0.254: 40.12,50 40.11,49.99 ; 40.12,50 40.12,50 Rfbb.2 ; 40.12,50 40.62,50.5 40.62,52.86 40.5,52.98
$1N19762: length 2.1
  Top Layer w0.254: 53.11,18 53.11,17.47 52.69,17.05 52.69,16.11 52.69,16.11
$1N20731: length 2.6
  Top Layer w0.254: 4.93,17.89 7.55,17.89 7.55,17.9
$1N20763: length 2.6
  Top Layer w0.254: 4.94,21.25 4.95,21.26 7.56,21.26
$1N20795: length 2.7
  Top Layer w0.254: 7.59,14.56 4.93,14.56 4.92,14.55
$1N20827: length 1.8
  Top Layer w0.254: 61.05,26.51 62.82,26.51 LED4.2
$1N20859: length 1.8
  Top Layer w0.254: 61.03,28.56 62.83,28.56

Small or netless copper shapes (teardrops, artwork), in the pictures only: 269 on Top Layer, 158 on Bottom Layer
